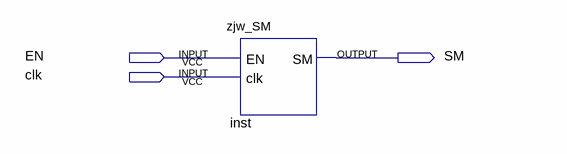
[diagram p0: schematic sheet]
// Quartus schematic Block1.bdf as structural Verilog: 1 symbols, 3 pins
module Block1 (
  input  EN,
  input  clk,
  output SM
);

  zjw_SM inst (.EN(EN), .clk(clk), .SM(SM));
endmodule
